# Altium project ups.PrjPcb
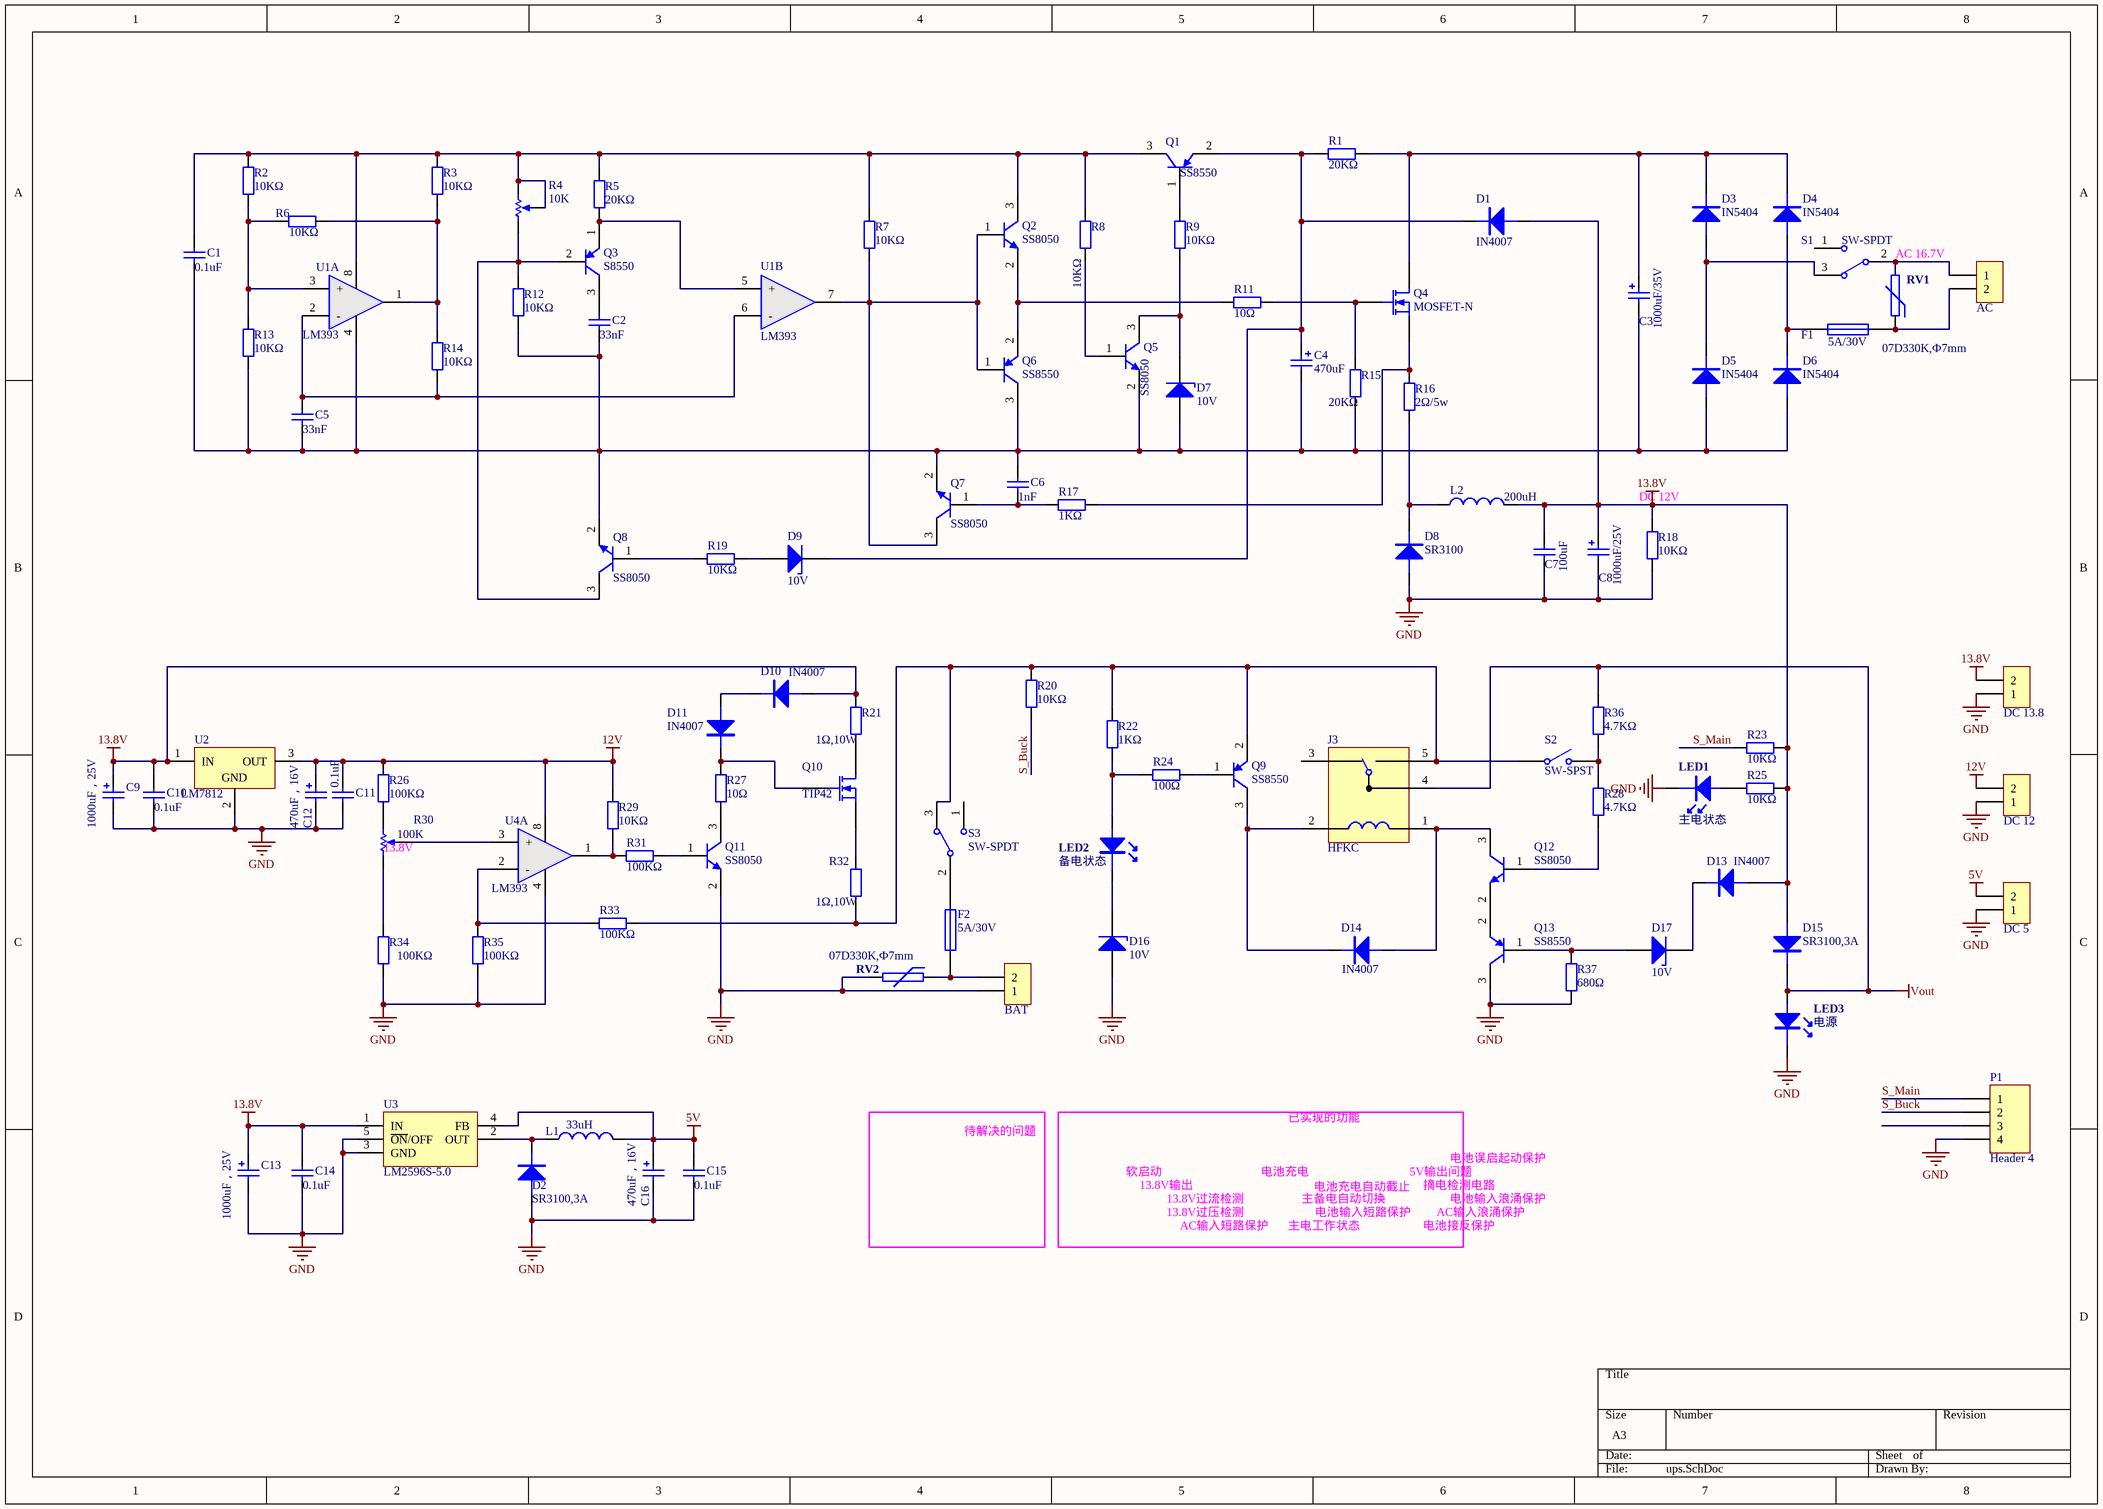
[diagram p0: ups.SchDoc]
1 sheet, 104 parts. Net scope: global (net labels, ports and power ports of the same name join across sheets).
Board file: ups.PcbDoc

## Sheet ups.SchDoc
size A3

### Parts
AC  CON2  [CON-2-5.08]  (value not drawn)
BAT  CON2  [CON-2-5.08]  (value not drawn)
C1  0.1uF  [C-RAD]
C2  33nF  [C-RAD]
C3  1000uF/35V  [C-RB-18]
C4  470uF  [C-RB-10]
C5  33nF  [C-RAD]
C6  1nF  [C-RAD]
C7  100uF  [C-RB-8]
C8  1000uF/25V  [C-RB-12]
C9  1000uF，25V  [C-RB-10]
C10  0.1uF  [C-RAD]
C11  0.1uF  [C-RAD]
C12  470uF，16V  [C-RB-8]
C13  1000uF，25V  [C-RB-10]
C14  0.1uF  [C-RAD]
C15  0.1uF  [C-RAD]
C16  470uF，16V  [C-RB-8]
D1  IN4007  [DO-41]
D2  SR3100,3A  [DO-201AD]
D3  IN5404  [DO-201AD]
D4  IN5404  [DO-201AD]
D5  IN5404  [DO-201AD]
D6  IN5404  [DO-201AD]
D7  value 10V  [DIODE-AXL]  (hidden comment: Diode-Z)
D8  SR3100  [DO-201AD]
D9  value 10V  [DIODE-AXL]  (hidden comment: Diode-Z)
D10  IN4007  [DO-41]
D11  IN4007  [DO-41]
D13  IN4007  [DO-41]
D14  IN4007  [DO-41]
D15  SR3100,3A  [DO-201AD]
D16  value 10V  [DIODE-AXL]  (hidden comment: Diode-Z)
D17  value 10V  [DIODE-AXL]  (hidden comment: Diode-Z)
DC_5  CON2  [CON-2-5.08]  (value not drawn)
DC_12  CON2  [CON-2-5.08]  (value not drawn)
DC_13.8  CON2  [CON-2-5.08]  (value not drawn)
F1  5A/30V  [BLX-A]
F2  5A/30V  [PIN-W2/E2.8]
J3  HFKC  [HF3FF-12]
L1  33uH  [C-RB-8]
L2  200uH  [C-RB-8]
LED1  value 主电状态  [LED_A2]  (hidden comment: Error)
LED2  value 备电状态  [LED_A2]  (hidden comment: Error)
LED3  value 电源  [LED_A2]  (hidden comment: Error)
P1  Header 4  [HDR1X4]
Q1  SS8550  [TO-92-3]
Q2  SS8050  [TO-92-3]
Q3  S8550  [TO-92-3]
Q4  MOSFET-N  [TO-220-3]
Q5  SS8050  [TO-92-3]
Q6  SS8550  [TO-92-3]
Q7  SS8050  [TO-92-3]
Q8  SS8050  [TO-92-3]
Q9  SS8550  [TO-92-3]
Q10  TIP42  [TO-220-3]
Q11  SS8050  [TO-92-3]
Q12  SS8050  [TO-92-3]
Q13  SS8550  [TO-92-3]
R1  20KΩ  [AXIAL-0.4]
R2  10KΩ  [AXIAL-0.4]
R3  10KΩ  [AXIAL-0.4]
R4  value 10K  [VR_A1]  (hidden comment: RPot)
R5  20KΩ  [AXIAL-0.4]
R6  10KΩ  [AXIAL-0.4]
R7  10KΩ  [AXIAL-0.4]
R8  10KΩ  [AXIAL-0.4]
R9  10KΩ  [AXIAL-0.4]
R11  10Ω  [AXIAL-0.4]
R12  10KΩ  [AXIAL-0.4]
R13  10KΩ  [AXIAL-0.4]
R14  10KΩ  [AXIAL-0.4]
R15  20KΩ  [AXIAL-0.4]
R16  2Ω/5w  [AXIAL-1.0]
R17  1KΩ  [AXIAL-0.4]
R18  10KΩ  [AXIAL-0.4]
R19  10KΩ  [AXIAL-0.4]
R20  10KΩ  [AXIAL-0.4]
R21  1Ω,10W  [AXIAL-1.0]
R22  1KΩ  [AXIAL-0.4]
R23  10KΩ  [AXIAL-0.4]
R24  100Ω  [AXIAL-0.4]
R25  10KΩ  [AXIAL-0.4]
R26  100KΩ  [AXIAL-0.4]
R27  10Ω  [AXIAL-0.4]
R28  4.7KΩ  [AXIAL-0.4]
R29  10KΩ  [AXIAL-0.4]
R30  value 100K  [VR_A1]  (hidden comment: RPot)
R31  100KΩ  [AXIAL-0.4]
R32  1Ω,10W  [AXIAL-1.0]
R33  100KΩ  [AXIAL-0.4]
R34  100KΩ  [AXIAL-0.4]
R35  100KΩ  [AXIAL-0.4]
R36  4.7KΩ  [AXIAL-0.4]
R37  680Ω  [AXIAL-0.4]
RV1  07D330K,Ф7mm  [AX-5P-9DX4.6T]
RV2  07D330K,Ф7mm  [AX-5P-9DX4.6T]
S1  SW-SPDT  [SWITCH_A3]
S2  SW-SPST  [SW_4]
S3  SW-SPDT  [SWITCH_A3]
U1  LM393  [DIP-8]  (parts A,B of 2)
U2  LM7812  [TO-220-3]
U3  LM2596S-5.0  [TO-220-5A]
U4  LM393  [DIP-8]  (part A of 2)

### Nets
5V: C15.2 C16.1 DC_5.2 L1.2 U3.4(FB)
12V: C11.2 C12.1 DC_12.2 R26.2 R29.2 U2.3(OUT) U4.8(VCC)
13.8V: C7.2 C8.1 C9.1 C10.2 C13.1 C14.2 D1.1(A) D10.1(A) D13.1(A) D15.1(A) DC_13.8.2 L2.1 R18.1 R21.1 R23.1 R25.1 U2.1(IN) U3.1(IN)
GND: BAT.1 C7.1 C8.2 C9.2 C10.1 C11.1 C12.2 C13.2 C14.1 C15.1 C16.2 D2.1(A) D8.1(A) D16.1(A) DC_5.1 DC_12.1 DC_13.8.1 LED1.2 LED3.2 P1.4 Q11.2(E) Q13.3(C) R18.2 R34.1 R35.1 R37.2 RV2.2 U2.2(GND) U3.3(GND) U3.5(~{ON}/OFF) U4.4(GND)
Vout: D15.2(K) J3.4 LED3.1 R36.2
S_Buck: P1.2 R20.2
S_Main: P1.1 R23.2
NetAC_1: AC.1 RV1.2 S1.2
NetAC_2: AC.2 F1.1 RV1.1
NetBAT_2: BAT.2 F2.2 RV2.1
NetC1_1: C1.1 C2.1 C3.2 C4.2 C5.1 C6.2 D5.1(A) D6.1(A) D7.1(A) Q5.2(E) Q6.3(C) Q7.2(E) Q8.2(E) R12.1 R13.1 R15.2 U1.4(GND)
NetC1_2: C1.2 Q1.3(C) Q2.3(C) R2.2 R3.2 R4.2(TAP) R4.3(BOT) R5.2 R7.2 R8.1 U1.8(VCC)
NetC2_2: C2.2 Q3.3(C)
NetC3_1: C3.1 D3.2(K) D4.2(K) Q4.1(D) R1.2
NetC4_1: C4.1 D1.2(K) D9.2(K) Q1.2(E) R1.1
NetC5_2: C5.2 R14.1 U1.2(-) U1.6(-)
NetC6_1: C6.1 Q7.1(B) R17.1
NetD2_2: D2.2(K) L1.1 U3.2(OUT)
NetD3_1: D3.1(A) D5.2(K) S1.3
NetD4_1: D4.1(A) D6.2(K) F1.2
NetD7_2: D7.2(K) Q5.3(C) R9.2
NetD8_2: D8.2(K) L2.2 R16.2
NetD9_1: D9.1(A) R19.2
NetD10_2: D10.2(K) D11.1(A)
NetD11_2: D11.2(K) Q10.2(G) R27.1
NetD13_2: D13.2(K) D17.2(K)
NetD14_1: D14.1(A) J3.1 Q12.3(C)
NetD14_2: D14.2(K) J3.2 Q9.3(C)
NetD16_2: D16.2(K) LED2.2
NetD17_1: D17.1(A) Q13.1(B) R37.1
NetF2_1: F2.1 S3.2
NetJ3_5: J3.5 Q9.2(E) R20.1 R22.1 R32.2 R33.2 S2.1(COMMON) S3.3
NetLED1_1: LED1.1 R25.2
NetLED2_1: LED2.1 R22.2 R24.1
NetQ1_1: Q1.1(B) R9.1
NetQ2_1: Q2.1(B) Q6.1(B) Q7.3(C) R7.1 U1.7(OUT2)
NetQ2_2: Q2.2(E) Q6.2(E) R11.1
NetQ3_1: Q3.1(E) R5.1 U1.5(+)
NetQ3_2: Q3.2(B) Q8.3(C) R4.1(TOP) R12.2
NetQ4_2: Q4.2(G) R11.2 R15.1
NetQ4_3: Q4.3(S) R16.1 R17.2
NetQ5_1: Q5.1(B) R8.2
NetQ8_1: Q8.1(B) R19.1
NetQ9_1: Q9.1(B) R24.2
NetQ10_1: Q10.1(D) R21.2
NetQ10_3: Q10.3(S) R32.1
NetQ11_1: Q11.1(B) R31.2
NetQ11_3: Q11.3(C) R27.2
NetQ12_1: Q12.1(B) R28.1
NetQ12_2: Q12.2(E) Q13.2(E)
NetR2_1: R2.1 R6.2 R13.2 U1.3(+)
NetR3_1: R3.1 R6.1 R14.2 U1.1(OUT1)
NetR26_1: R26.1 R30.3(BOT)
NetR28_2: R28.2 R36.1 S2.2(NO)
NetR29_1: R29.1 R31.1 U4.1(OUT1)
NetR30_1: R30.1(TOP) R34.2
NetR30_2: R30.2(TAP) U4.3(+)
NetR33_1: R33.1 R35.2 U4.2(-)

Not connected (* = marked no-connect by the designer): J3 3; P1 3; S1 1; S3 1

### Notes on the sheet
- (near RV1) AC 16.7V
- DC 12V
- (near R30) 13.8V
- 已实现的功能
- 待解决的问题
- 软启动
- 13.8V输出
- 电池充电
- 电池充电自动截止
- 5V输出问题
- 摘电检测电路
- 电池误启起动保护
- 13.8V过流检测
- 13.8V过压检测
- AC输入短路保护
- 主电工作状态
- 主备电自动切换
- 电池输入短路保护
- 电池接反保护
- AC输入浪涌保护
- 电池输入浪涌保护

### Library data of the parts
AC BAT DC_5 DC_12 DC_13.8 = CON2: 2EDGR/2EDGK-5.08-2P,DEGSON; 物料代码: 1.10.06.0027; 名称: 端子; 贴片和直插: THT; Value: 2EDGR/2EDGK-5.08-2P; 厂商: DEGSON; 型号: 2EDGR/2EDGK-5.08-2P; ComponentLink1Description: ErpDataInfo; ComponentLink1URL: http://erp.zlgmcu.com/ErpExt/ErpData/ListMateriel.aspx?pkey=1.10.06.0027
C1 C2 C5-C7 C10 C11 C14 C15 = Cap: 电容; Published: 8-Jun-2000; LatestRevisionDate: 17-Jul-2002; LatestRevisionNote: Re-released for DXP Platform.; PackageReference: RAD-0.3; Publisher: Altium Limited
  C1 C10 C11 C14 C15: Value: 0.1uF
  C2 C5: Value: 33nF
  C6: Value: 1nF
  C7: Value: 100uF
C3 C4 C8 C9 C12 C13 C16 = Cap Pol3: 大容量电容; Value: ？uF; Published: 8-Jun-2000; LatestRevisionDate: 17-Jul-2002; LatestRevisionNote: Re-released for DXP Platform.; PackageReference: 1206+; Publisher: Altium Limited
D1 D3-D6 D8 D10 D11 D13-D15 = DIODE: 二极管
D2 = DIODE
D7 D9 D16 D17 = Diode-Z: 稳压二极管; Published: 8-Jun-2000; LatestRevisionDate: 17-Jul-2002; LatestRevisionNote: Re-released for DXP Platform.; PackageReference: SMB; Publisher: Altium Limited; Code_JEDEC: DO-214-AA
F1 F2 = Fuse 1: Fuse; Published: 8-Jun-2000; LatestRevisionDate: 17-Jul-2002; LatestRevisionNote: Re-released for DXP Platform.; PackageReference: PIN-W2/E2.8; Publisher: Altium Limited; PackageDescription: Thru-Hole; 2 Leads
J3 = HFKC: 单刀双掷继电器
L1 L2 = INDUCTOR
LED1-LED3 = LED1: 红色,0603,0603,*,RoHS; 物料代码: 1.04.05.0008; 名称: 发光二极管; 封装: 0603; 设备封装名称: LED0603-RED; 贴片和直插: SMT; 器件优选方案: 优先选用; RoHS: RoHS; 型号: 红色,0603; ComponentLink1Description: ErpDataInfo; ComponentLink1URL: http://erp.zlgmcu.com/ErpExt/ErpData/ListMateriel.aspx?pkey=1.04.05.0008
P1 = Header 4: Header, 4-Pin; LatestRevisionDate: 17-Jul-2002; LatestRevisionNote: Re-released for DXP Platform.; Publisher: Altium Limited
Q1 Q6 Q9 Q13 = SS8550: PNP贴片三极管; Published: 8-Jun-2000; LatestRevisionDate: 15-Jan-2003; LatestRevisionNote: PCB Footprint 'BCY-W3/D4.7' replaced; DatasheetDocument: 1997; PackageDocument: Sep-1998; PackageReference: TO-92A; Publisher: Altium Limited; Code_JEDEC: TO-92A; ComponentLink1Description: Manufacturer Link; ComponentLink1URL: http://www.fairchildsemi.com/; ComponentLink2Description: Datasheet; ComponentLink2URL: http://www.fairchildsemi.com/ds/2N%2F2N3906.pdf
Q2 Q5 Q7 Q8 Q11 Q12 = SS8050: NPN贴片三极管; Published: 8-Jun-2000; LatestRevisionDate: 15-Jan-2003; LatestRevisionNote: PCB Footprint 'BCY-W3/D4.7' replaced; DatasheetDocument: 1997; PackageDocument: Sep-1998; PackageReference: TO-92A; Publisher: Altium Limited; Code_JEDEC: TO-92A; ComponentLink1Description: Manufacturer Link; ComponentLink1URL: http://www.fairchildsemi.com/; ComponentLink2Description: Datasheet; ComponentLink2URL: http://www.fairchildsemi.com/ds/2N%2F2N3904.pdf
Q3 = S8550: PNP三极管; Published: 8-Jun-2000; LatestRevisionDate: 15-Jan-2003; LatestRevisionNote: PCB Footprint 'BCY-W3/D4.7' replaced; DatasheetDocument: 1997; PackageDocument: Sep-1998; PackageReference: TO-92A; Publisher: Altium Limited; Code_JEDEC: TO-92A; ComponentLink1Description: Manufacturer Link; ComponentLink1URL: http://www.fairchildsemi.com/; ComponentLink2Description: Datasheet; ComponentLink2URL: http://www.fairchildsemi.com/ds/2N%2F2N3906.pdf
Q4 Q10 = MOSFET-N: N-Channel MOSFET; Published: 8-Jun-2000; LatestRevisionDate: 17-Jul-2002; LatestRevisionNote: Re-released for DXP Platform.; PackageVersion: 1995/1996; PackageReference: E3; Publisher: Altium Limited; PackageDescription: TO, Flat Index; 3 In-Line, Axial Leads; Body Dia. 4.6mm; Lead Dia. 0.5 mm (max)
R1-R3 R5-R9 R11-R29 R31-R37 = Res2: 电阻; Value: ？Ω; Published: 8-Jun-2000; LatestRevisionDate: 17-Jul-2002; LatestRevisionNote: Re-released for DXP Platform.; PackageReference: 1206; Publisher: Altium Limited
R4 R30 = RPot: 精密可调电阻; Sim Note: Enter the Resistance value and the set point into parameter fields.; Set Position: 0.5; Published: 8-Jun-2000; LatestRevisionDate: 17-Jul-2002; LatestRevisionNote: Re-released for DXP Platform.; PackageReference: VR5; Publisher: Altium Limited
RV1 RV2 = RES4: 220KD07,Ф8×3mm,RoHS; 物料代码: 1.01.13.0001; 名称: 压敏电阻; 贴片和直插: THT; RoHS: RoHS; 型号: 220KD07,Ф8×3mm; ComponentLink1Description: ErpDataInfo; ComponentLink1URL: http://erp.zlgmcu.com/ErpExt/ErpData/ListMateriel.aspx?pkey=1.01.13.0001; Value: 07D330K,Ф7mm
S1 S3 = SW-SPDT: 开关; Published: 24-Mar-1999; LatestRevisionDate: 17-Dec-2003; LatestRevisionNote: Schematic revised, PCB Footprint replaced.; DatasheetDocument: 05-Dec-2000; PackageReference: TL36WW15050; Publisher: Altium Limited; ComponentLink1Description: Manufacturer Link; ComponentLink1URL: http://www.apem.com
S2 = SW-SPST: Single-Pole, Single-Throw Switch; Published: 24-Mar-1999; LatestRevisionDate: 17-Jul-2002; LatestRevisionNote: Re-released for DXP Platform.; PackageReference: SPST-2; Publisher: Altium Limited; PackageDescription: Switch; 2 Leads
U1 U4 = LM393: 比较器，2
U2 = LM7818CT: Series 3-Terminal Positive Regulator; Note: Tab is connected to GND; ComponentAvailability: Obsolete; Published: 15-Apr-2002; DatasheetVersion: May-1999; PackageVersion: 1995; PackageReference: T03B; Publisher: Altium Limited; PackageDescription: TO, Thru-Hole, Vertical, Heatsink Mounted; 3 In-Line Leads; Pitch 2.54 mm; ComponentLink1Description: Manufacturer Link; ComponentLink1URL: http://www.national.com/; ComponentLink2Description: Discontinuation Notice; ComponentLink2URL: http://www.national.com/obs/obsolescence.txt
U3 = LM2596S-5.0: Simple Switcher Power Converter 150 kHz 3A Step Down Voltage Regulator; Note: Tab is connected to GND; Published: 15-Apr-2002; DatasheetVersion: Dec-1997; PackageReference: TS5B; Publisher: Altium Limited; PackageDescription: D2-PAK; 5 Leads; Body 14.4 (inc. leads) x 10.4 mm (LxW max); ComponentLink1Description: Manufacturer Link; ComponentLink1URL: http://www.national.com/; ComponentLink2Description: Datasheet; ComponentLink2URL: http://www.national.com/ds.cgi/LM/LM2596.pdf; ComponentLink3Description: URL Link1; ComponentLink3URL: http://www.national.com/pf/LM/LM2596.html